# EAGLE design V3 (EAGLE 6.5.0)

## Sheet 1 of 3: FET+Driver
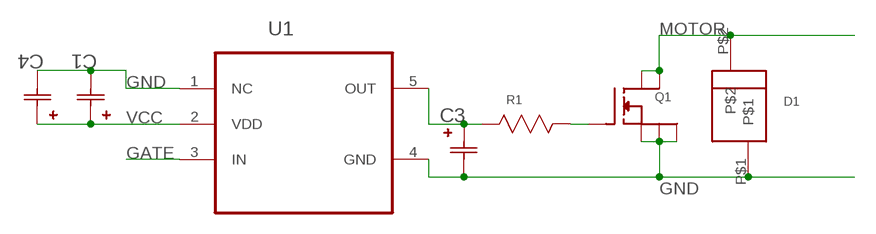
[diagram p0: schematic, sheet 1]

### Parts
C1  1UF  1206YC105KAT2A  [CAPC3216X127N]
C3  1uF  0603YC105KAT2A  [CAPC1608X94N]
C4  0.1UF  0603YC104K4T4A  [CAPC1608X90N]
D1  5.0SMDJ24ASMD  [DO-214AB]
Q1  PSMN039LFPAC  [LFPAC]
R1  100 Ohm  ERA-3AEB101V  [RESC1608X60N]
U1  NCS2001SN1T1G  [SOT95P275X110-5N]

### Nets
GATE: U1.3(IN) ; also sheet 3
GND: C1.2(C2) C3.2(C2) C4.2(C2) D1.P$1 Q1.1(S1) Q1.2(S2) Q1.3(S3) U1.1(NC) U1.4(GND) ; also sheet 2,3
MOTOR: D1.P$2 Q1.5(D1) Q1.6(D2) ; also sheet 3
N$1: Q1.4(G) R1.1(R1)
N$2: C3.1(C1) R1.2(R2) U1.5(OUT)
VCC: C1.1(C1) C4.1(C1) U1.2(VDD) ; also sheet 2

## Sheet 2 of 3: Control Power
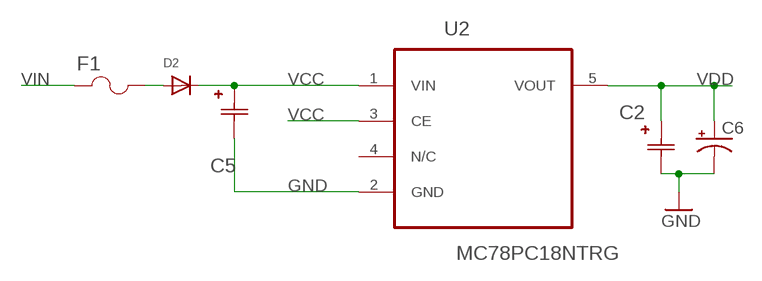
[diagram p1: schematic, sheet 2]

### Parts
C2  2200pF  06033C222JAT4A  [CAPC1608X90N]
C5  220UF  TAJD227K006RNJ  [CAPCP7343X430N]
C6  150uF  47UF-10V-10%(TANT)  [EIA3528]
D2  DIODESOD-123  [SOD-123]
F1  F1206B3R00FWTR  [FUSM3216X140N]
U2  MC78PC18NTRG  [SOT95P275X110-5N]

### Nets
GND: C2.2(C2) C5.2(C2) C6.C(-) U2.2(GND) ; also sheet 1,3
N$3: D2.A F1.2
VCC: C5.1(C1) D2.C U2.1(VIN) U2.3(CE) ; also sheet 1
VDD: C2.1(C1) C6.A(+) U2.5(VOUT) ; also sheet 3
VIN: F1.1
Unconnected: U2.4(N/C)

## Sheet 3 of 3: Control + Sensors
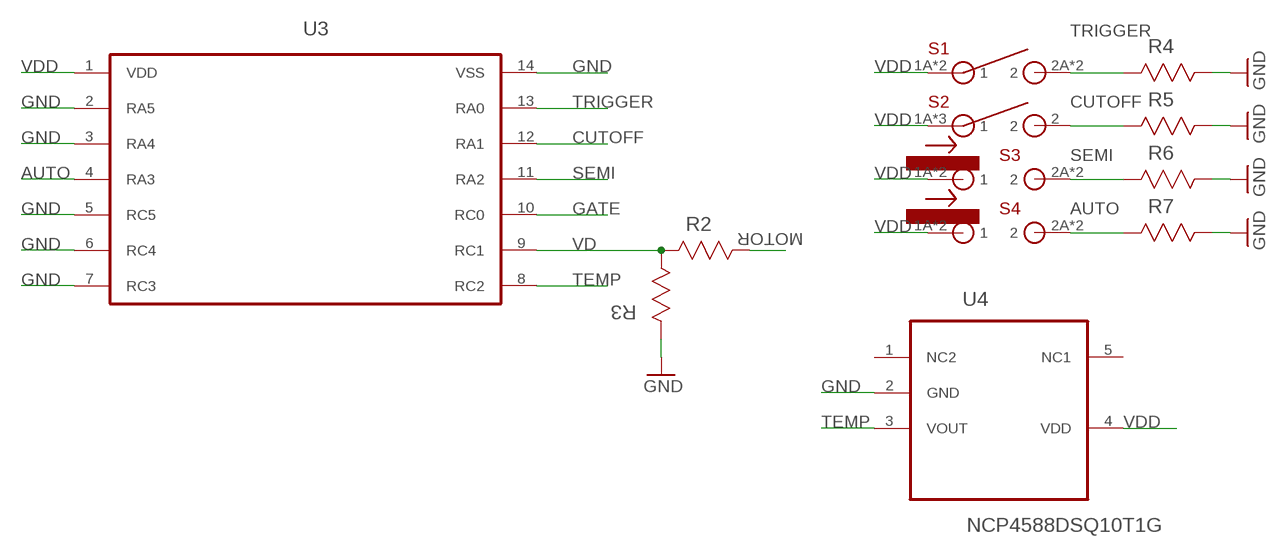
[diagram p2: schematic, sheet 3]

### Parts
R2  15 kOhm  ERA-3AEB153V  [RESC1608X60N]
R3  4.7 kOhm  ERA-3AEB472V  [RESC1608X60N]
R4  4.7 kOhm  ERA-3AEB472V  [RESC1608X60N]
R5  4.7 kOhm  ERA-3AEB472V  [RESC1608X60N]
R6  4.7 kOhm  ERA-3AEB472V  [RESC1608X60N]
R7  4.7 kOhm  ERA-3AEB472V  [RESC1608X60N]
S1  7914S-1-000E  [7914S-1-000E]
S2  ESE-31L15T  [ESE-31L15T]
S3  SPVM110100  [SPVM110100]
S4  SPVM110100  [SPVM110100]
U3  P89LPC912FDH,129  [SOP65P640X110-14N]
U4  NCP4588DSQ10T1G  [SOT65P210X110-5N]

### Nets
AUTO: R7.2(R2) S4.2A S4.2B U3.4(RA3)
CUTOFF: R5.2(R2) S2.2 U3.12(RA1)
GATE: U3.10(RC0) ; also sheet 1
GND: R3.2(R2) R4.1(R1) R5.1(R1) R6.1(R1) R7.1(R1) U3.2(RA5) U3.3(RA4) U3.5(RC5) U3.6(RC4) U3.7(RC3) U3.14(VSS) U4.2(GND) ; also sheet 1,2
MOTOR: R2.1(R1) ; also sheet 1
SEMI: R6.2(R2) S3.2A S3.2B U3.11(RA2)
TEMP: U3.8(RC2) U4.3(VOUT)
TRIGGER: R4.2(R2) S1.2A S1.2B U3.13(RA0)
VD: R2.2(R2) R3.1(R1) U3.9(RC1)
VDD: S1.1A S1.1B S2.1A S2.1B S2.1C S3.1A S3.1B S4.1A S4.1B U3.1(VDD) U4.4(VDD) ; also sheet 2
Unconnected: U4.5(NC1)

## Power pins joined to a net without a drawn wire
NC2: U4.1(NC2)

## Library data of the parts
C1 = AVX_By_element14_Batch_1:1206YC105KAT2A: Capacitor 1206; MPN: 1206YC105KAT2A; OC_FARNELL: 499717; OC_NEWARK: 25C3294; SUPPLIER: AVX; TOLERANCE: ±10%; VOLTAGERATING: 16V
C2 = AVX_By_element14_Batch_1:06033C222JAT4A: CAPACITOR , 0603; MPN: 06033C222JAT4A; OC_FARNELL: -; OC_NEWARK: 55J3954; SUPPLIER: AVX; TOLERANCE: ±5%; VOLTAGERATING: 25V
C3 = AVX_By_element14_Batch_1:0603YC105KAT2A: Capacitor 0603; MPN: 0603YC105KAT2A; OC_FARNELL: 1658870; OC_NEWARK: 96M1178; SUPPLIER: AVX; TOLERANCE: ±10%; VOLTAGERATING: 16V
C4 = AVX_By_element14_Batch_1:0603YC104K4T4A: Capacitor, 0603; MPN: 0603YC104K4T4A; OC_FARNELL: 1833863; OC_NEWARK: 85R5663; SUPPLIER: AVX; TOLERANCE: ±10%; VOLTAGERATING: 16V
C5 = AVX_By_element14_Batch_1:TAJD227K006RNJ: Tantalum Capacitor , 2917; CAPACITANCETOLERANCE: ±10%; MPN: TAJD227K006RNJ; OC_FARNELL: 1658172; OC_NEWARK: 15P3076; SUPPLIER: AVX; VOLTAGERATING: 6.3V
C6 = SparkFun-Capacitors:47UF-10V-10%(TANT): CAP-08310 47uF Tantalum SMT 10V 10% (EIA-3528); PROD_ID: CAP-08310; VALUE: 47uF
D1 = custom1:5.0SMDJ24A
D2 = adafruit:DIODE: Diode SMADIODE - SMA Surface Mount Package 20V 1A Schottky Diode Digikey: 641-1014-6-ND DO-1N4148 - Through Hole Small Current Diode SOD-123 20V 1 A (.5mV Vf) Schottky Diode - Digikey: MBRX120TPMSCT-ND SOD-323 10V 570mA (.38mV Vf, 3ns) Schottky Diode - Digikey: ZLLS410CT-ND SOD-523 30V 30mA Schottky Diode (RB751S-40TE61) - Digikey: RB751S-40TE61CT-ND SOT23-R/W - SOT23 Package (R = Solder Paste/Reflow Ovens, W = Hand-Soldering) BAT54Film 40V 300mA - Digikey: 497-7162-1-ND
F1 = AVX_By_element14_Batch_1:F1206B3R00FWTR: FUSE 2.00A 63V FAST THIN 1206; MPN: F1206B3R00FWTR; OC_FARNELL: 1514506; OC_NEWARK: 05H4220; PACKAGE: 1206; SUPPLIER: AVX
Q1 = lfpak mosfet:PSMN039: N-channel LFPAK 100 V 39.5 mΩ standard level MOSFET PSMN039-100YS General description Standard level N-channel MOSFET in LFPAK package qualified to 175 °C. This product is designed and qualified for use in a wide range of industrial, communications and domestic equipment. Features and benefits - Advanced TrenchMOS provides low RDSon and low gate charge - High efficiency gains in switching power converters - Improved mechanical and thermal characteristics - LFPAK provides maximum power density in a Power SO8 package Applications - DC-to-DC converters - Lithium-ion battery protection - Load switching - Motor control - Server power supplies Symbol Parameter Conditions Min Typ Max Unit VDS drain-source voltage Tj ≥ 25 °C; Tj ≤ 175 °C - - 100 V ID drain current Tmb = 25 °C; VGS = 10 V; - - 28.1 A Ptot total powerdissipation Tmb = 25 °C; - - 74 W Tj junction temperature -55 - 175 °C EDS(AL)S non-repetitive drain-source avalanche energy VGS = 10 V; Tj(init) = 25 °C; ID = 28.1 A; Vsup ≤ 100 V; unclamped; RGS = 50 Ω - - 42 mJ QGD gate-drain charge VGS = 10 V; ID = 15 A; VDS = 50 V; - 8 - nC QG(tot) total gate charge - 23 - nC; MPN: PSMN0R9-25YLC,115; OC_FARNELL: 1845636; PACKAGE: LFPAC; SUPPLIER: NXP
R1 = Panasonic_By_element14_Batch_1:ERA-3AEB101V: RESISTOR, 0603; MPN: ERA-3AEB101V; OC_FARNELL: 1577593; OC_NEWARK: 08N2093; SUPPLIER: Panasonic; TOLERANCE: ±0.1%; WATTAGE: 0.1 W
R2 = Panasonic_By_element14_Batch_1:ERA-3AEB153V: RESISTOR, 0603; MPN: ERA-3AEB153V; OC_FARNELL: 1811358; OC_NEWARK: 08N2103; SUPPLIER: Panasonic; TOLERANCE: ±0.1%; WATTAGE: 0.1 W
R3-R7 = Panasonic_By_element14_Batch_1:ERA-3AEB472V: RESISTOR, 0603; MPN: ERA-3AEB472V; OC_FARNELL: 1811387; OC_NEWARK: 08N2126; SUPPLIER: Panasonic; TOLERANCE: ±0.1%; WATTAGE: 0.1 W
S1 = custom1:7914S-1-000E
S2 = custom1:ESE-31L15T
S3 S4 = custom1:SPVM110100
U1 = Banshee:NCS2001SN1T1G: Operational Amplifier; MPN: NCS2001SN1T1G; OC_FARNELL: 1364638; OC_NEWARK: 45J1978; PACKAGE: SOT-23-5; SUPPLIER: ON SEMICONDUCTOR
U2 = ON Semiconductor_By_element14_Batch_1:MC78PC18NTRG: Linear Voltage Regulator; MPN: MC78PC18NTRG; OC_FARNELL: 1130695; OC_NEWARK: 88H4756; PACKAGE: SOT-23-5; SUPPLIER: ON SEMICONDUCTOR
U3 = Banshee:P89LPC912FDH,129: 8-bit microcontrollers with two-clock 80C51 core, 1 kB 3 V flash with 128-byte RAM; MPN: P89LPC912FDH,129; OC_FARNELL: -; OC_NEWARK: 70R8555; PACKAGE: TSSOP-14; SUPPLIER: NXP
U4 = Banshee:NCP4588DSQ10T1G: Linear Voltage Regulator; MPN: NCP4588DSQ10T1G; OC_FARNELL: 1885130; OC_NEWARK: 41T0735; PACKAGE: SC70-5; SUPPLIER: ON SEMICONDUCTOR

## Board
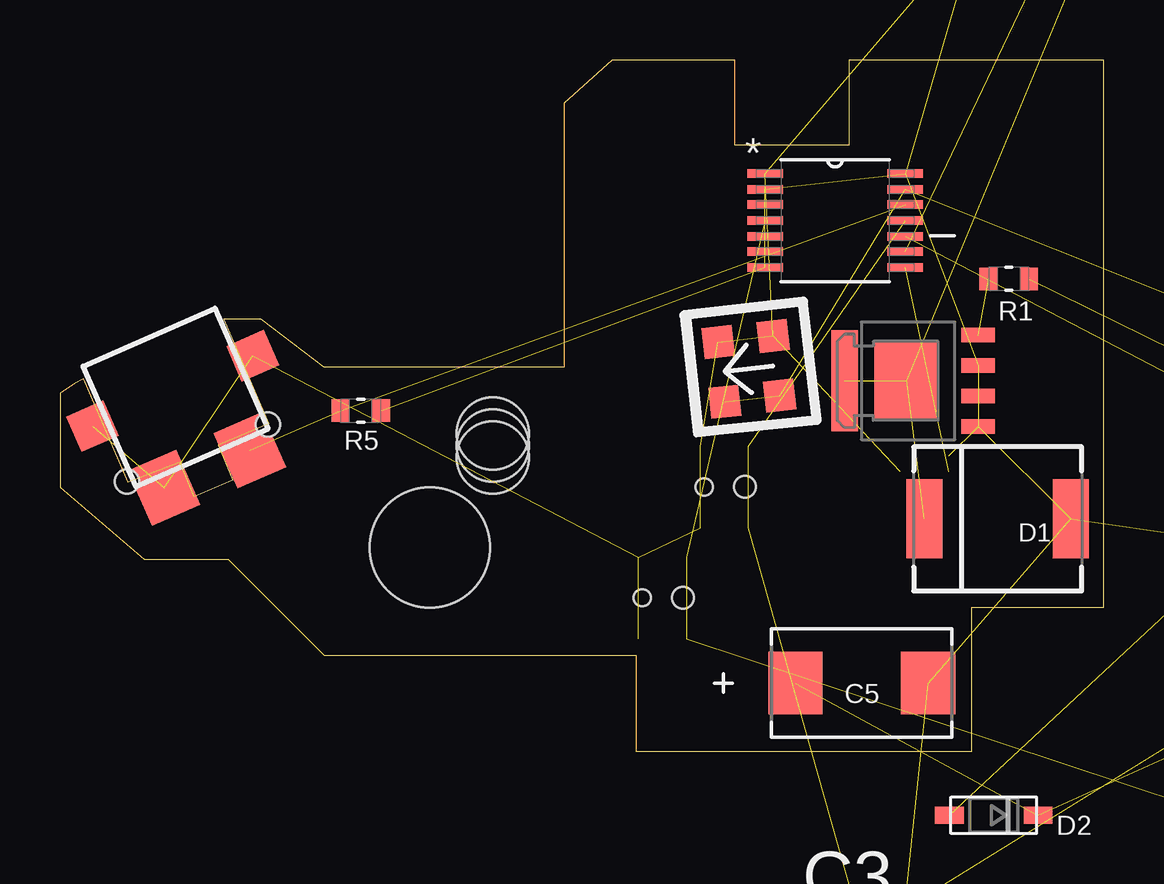
[diagram p3: board, top side]
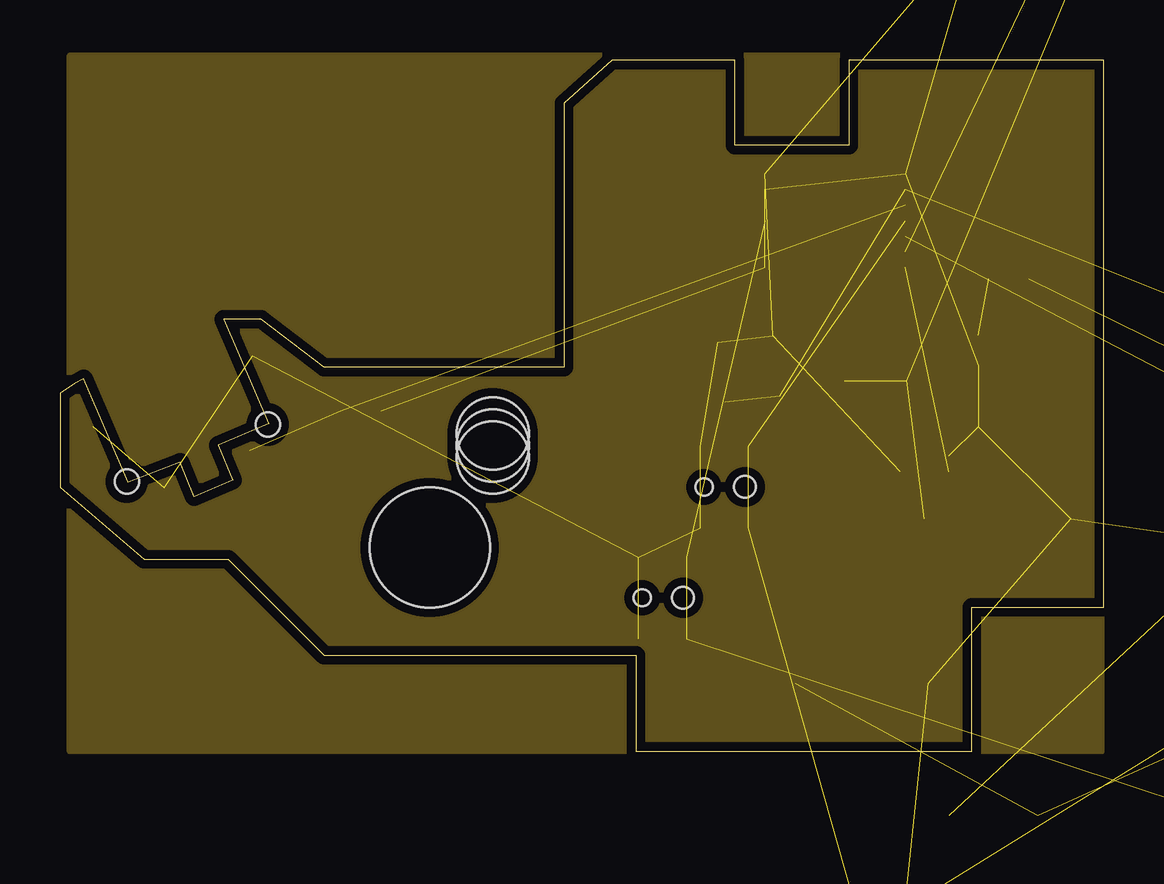
[diagram p4: board, inner layer Route2]
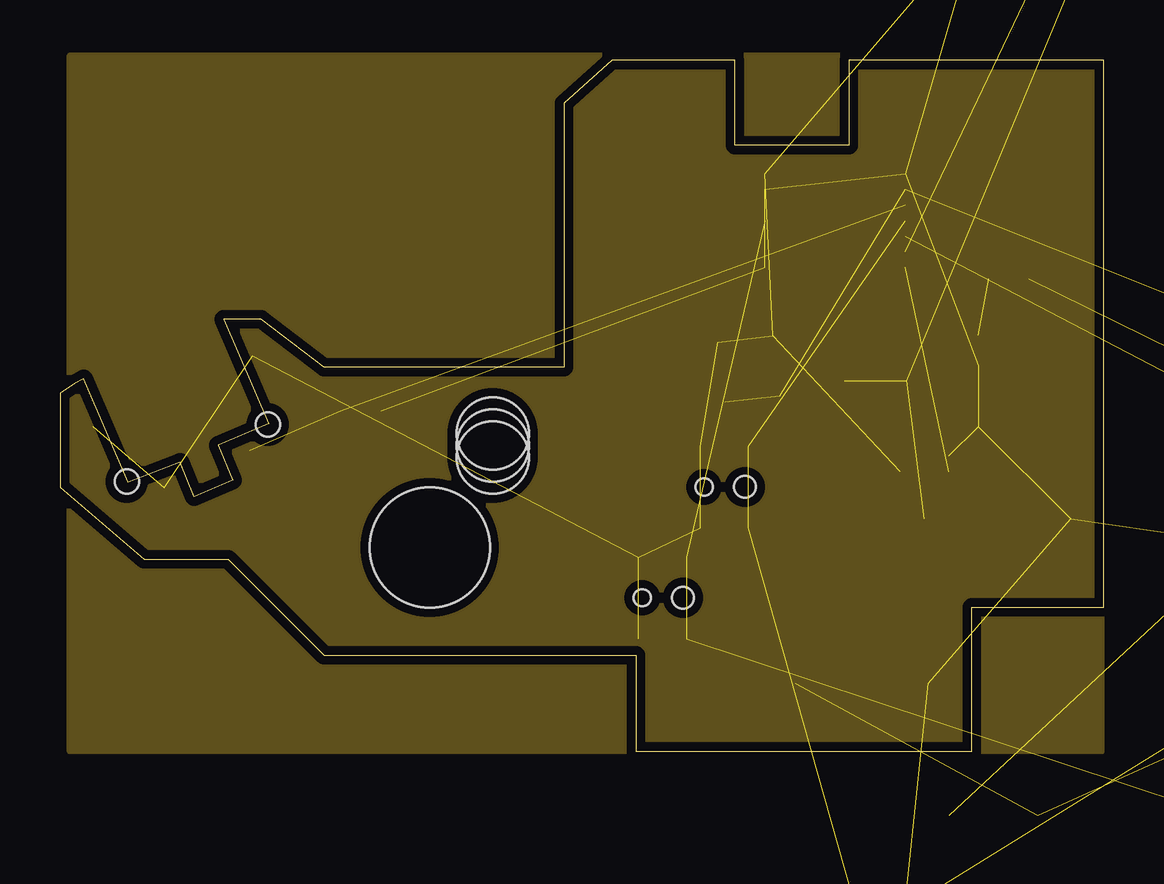
[diagram p5: board, inner layer Route15]
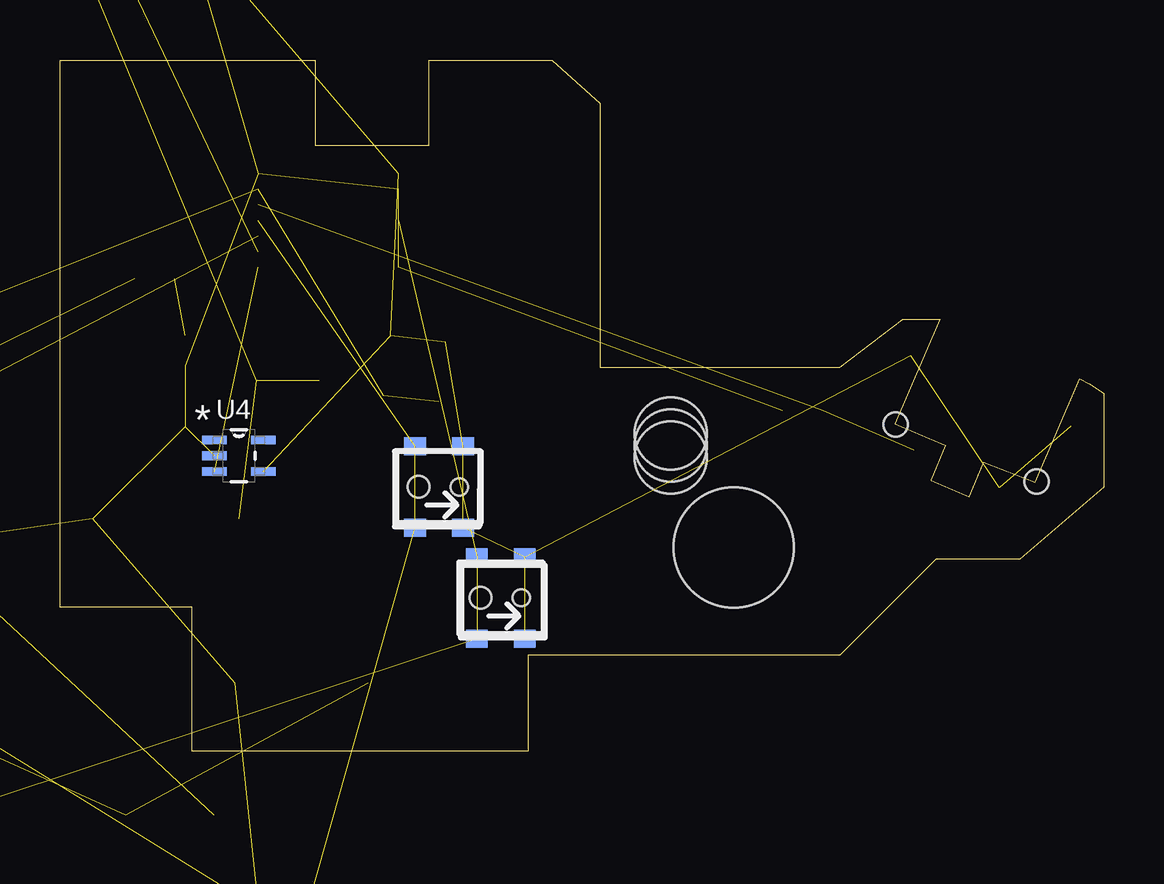
[diagram p6: board, bottom side, seen from below]

Size 43.5 x 28.8 mm. Coordinates in mm from the lower left corner, seen from the top.
Outline: 0,11 3.5,8 7,8 11,4 24,4 24,0 38,0 38,6 43.5,6 43.5,28.8 32.88,28.8 32.88,25.25 28.12,25.25 28.12,28.8 23,28.8 21,27 21,16 11,16 8.38,18 6.82,18 8.7,13.65 6.6,12.75 7.2,11.3 5.6,10.6 5,12.05 2.85,11.2 0.98,15.53 0.6,15.3 0,14.93 0,11
Copper layers (1*2*15*16): Top 0.035559375mm / dielectric 0.17018125mm / Route2 0.01778125mm / dielectric 47mil / Route15 0.01778125mm / dielectric 0.17018125mm / Bottom 0.035559375mm
Design rules "OSHPark-4layer *": minimum track width 5mil, minimum drill 10mil, track to track 5mil, track to pad 5mil, pad to pad 5mil, via to via 5mil, smd to smd 5mil, copper to edge 15mil, drill to drill 6mil, minimum pad ring 4mil, minimum via ring 4mil, stop-mask expansion 4mil, vias tented up to drill 26mil, thermal gap 10mil
Holes 5 mm at 15.41,8.49
Holes 3 mm at 18.04,12.74 18.04,12.24 18.04,13.24
Holes 1 mm at 2.79,11.24 8.66,13.62
bKeepout: area 24,0 to 38,1.5; area 38.5,6 to 43.5,28.8; area 20.4,13.5 to 43.4,29; area -0.1,1.5 to 22.9,19
tRestrict: area 31.4,7.5 to 34.9,13; area 39.4,12 to 42.4,17.5

### Footprints (pad centres in the part's own frame; a part is rotated, then mirrored left to right if it is on the bottom)
CAPC3216X127N = smd 1.118 x 1.803: 1 -1.499,0; 2 1.499,0
CAPC1608X90N = smd 0.864 x 0.965: 1 -0.813,0; 2 0.813,0
CAPC1608X94N = smd 0.66 x 0.94: 1 -0.711,0; 2 0.711,0
CAPCP7343X430N = smd 2.261 x 2.591: 1 -2.769,0; 2 2.769,0
EIA3528 = smd 1.2 x 2.5: A 1.65,0; C -1.65,0
DO-214AB = smd 1.5 x 3.3: P$1 -3.05,0; P$2 3.05,0
SOD-123 = smd 1.2 x 0.7: A 1.85,0; C -1.85,0
FUSM3216X140N = smd 1.118 x 1.803: 1 -1.499,0; 2 1.499,0
LFPAC = smd 0.6 x 1.4: 1 -1.905,-2.945; 2 -0.635,-2.945; 3 0.635,-2.945; 4 1.905,-2.945 | smd 4.2 x 1.1: 5 0,2.625 | smd 3.3 x 2.7: 6 0,0.025
RESC1608X60N = smd 0.762 x 0.94: 1 -0.838,0; 2 0.838,0
7914S-1-000E = smd 1.3 x 1.25: 1A -1.252,1.151; 1B -1.252,-1.151; 2A 1.252,1.151; 2B 1.252,-1.151
ESE-31L15T = smd 1.7 x 1.6: 1A -3.65,1.3; 1B 3.65,1.3 | smd 2.2 x 2.5: 1C -1.95,-2.25; 2 1.95,-2.25
SPVM110100 = smd 0.75 x 0.9: 1A -1.7,1; 1B 1.7,1; 2A -1.7,-1; 2B 1.7,-1 | hole 0.9: 0,-0.85 | hole 0.7: 0,0.85
SOT95P275X110-5N = smd 1.321 x 0.559: 1 -1.27,0.94; 2 -1.27,0; 3 -1.27,-0.94; 4 1.27,-0.94; 5 1.27,0.94
SOP65P640X110-14N = smd 1.473 x 0.356: 1 -2.921,1.956; 2 -2.921,1.295; 3 -2.921,0.66; 4 -2.921,0; 5 -2.921,-0.66; 6 -2.921,-1.295; 7 -2.921,-1.956; 8 2.921,-1.956; 9 2.921,-1.295; 10 2.921,-0.66; 11 2.921,0; 12 2.921,0.66; 13 2.921,1.295; 14 2.921,1.956
SOT65P210X110-5N = smd 1.016 x 0.356: 1 -1.016,0.66; 2 -1.016,0; 3 -1.016,-0.66; 4 1.016,-0.66; 5 1.016,0.66

### Placement (x,y rotation side)
C1  75.55,32.01 180 top  (outside the outline)
C2  39.91,37.3 180 top  (outside the outline)
C3  34.41,-7.51 0 top  (outside the outline)
C4  79.4,-4.18 0 top  (outside the outline)
C5  33.42,2.84 0 top
C6  86.34,18.03 0 top  (outside the outline)
D1  39.09,9.68 180 top
D2  38.92,-2.67 180 top
F1  48.5,6.45 90 top  (outside the outline)
Q1  35.33,15.43 90 top
R1  39.55,19.68 0 top
R2  47.72,46.16 90 top  (outside the outline)
R3  74.82,40.06 270 top  (outside the outline)
R4  73.22,8.58 180 top  (outside the outline)
R5  12.54,14.19 180 top
R6  37.04,-17.21 180 top  (outside the outline)
R7  66.27,-8.31 180 top  (outside the outline)
S1  28.72,15.93 276.4 top
S2  5.22,13.82 23.7 top
S3  27.7,11.01 270 bottom
S4  25.12,6.39 270 bottom
U1  62.09,8.2 90 top  (outside the outline)
U2  57.16,39.7 90 top  (outside the outline)
U3  32.31,22.11 0 top
U4  36.04,12.31 0 bottom

### Tracks (layer width: path | path; a pad name or v marks a point on that pad's centre or on a via)
AUTO  (3 unrouted)
CUTOFF  (2 unrouted)
GATE  (1 unrouted)
GND  (24 unrouted)
  pour Route2: 0.41,28.99 43.41,28.99 43.41,-0.01 0.41,-0.01
MOTOR  (3 unrouted)
N$1  (1 unrouted)
N$2  (2 unrouted)
N$3  (1 unrouted)
SEMI  (3 unrouted)
TEMP  (1 unrouted)
TRIGGER  (3 unrouted)
VCC  (6 unrouted)
VD  (2 unrouted)
VDD  (13 unrouted)
  pour Route15: 0.41,28.99 43.41,28.99 43.41,-0.01 0.41,-0.01